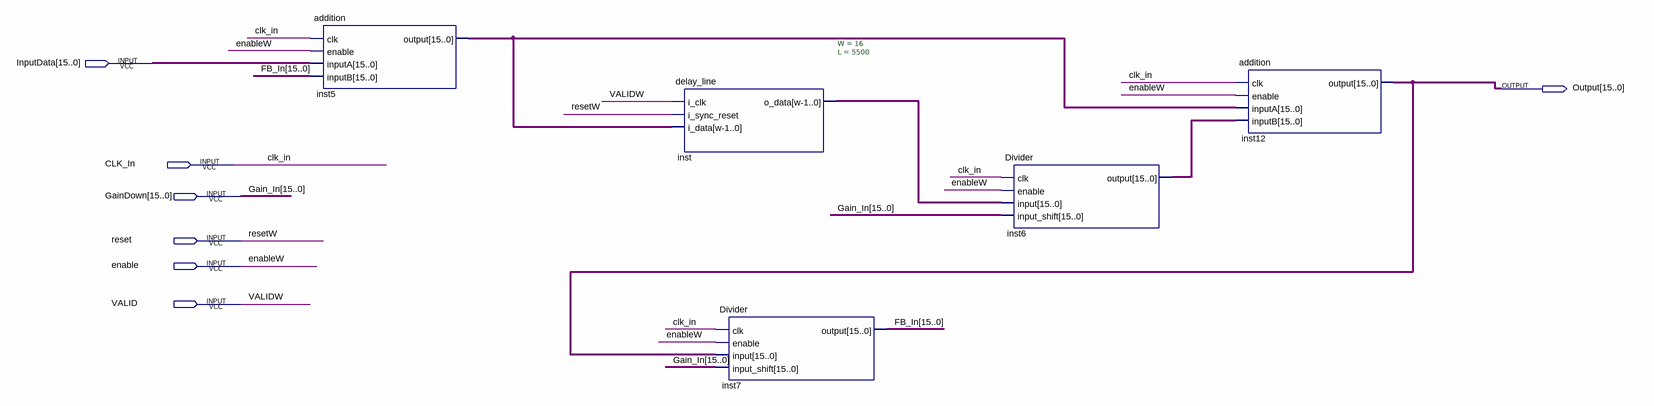
[diagram p0: schematic sheet]
// Quartus schematic ECHOTEST01.bdf as structural Verilog: 5 symbols, 7 pins
module ECHOTEST01 (
  input  [15:0] InputData,
  input  CLK_In,
  input  [15:0] GainDown,
  input  reset,
  input  enable,
  input  VALID,
  output [15:0] Output
);

  wire [15:0] FB_In, inst5_output, inst6_output, inst_o_data;

  addition inst5 (.clk(CLK_In), .enable(enable), .inputA(InputData), .inputB(FB_In), .\output (inst5_output));
  delay_line #(.W(16), .L(5500)) inst (
    .i_clk(VALID), .i_sync_reset(reset), .i_data(inst5_output), .o_data(inst_o_data));
  Divider inst7 (.clk(CLK_In), .enable(enable), .\input (Output), .input_shift(GainDown), .\output (FB_In));
  Divider inst6 (.clk(CLK_In), .enable(enable), .\input (inst_o_data), .input_shift(GainDown), .\output (inst6_output));
  addition inst12 (.clk(CLK_In), .enable(enable), .inputA(inst5_output), .inputB(inst6_output), .\output (Output));

  // Other names for the same wires on the sheet: enableW = enable; Gain_In[15:0] = GainDown; resetW = reset;
  //   VALIDW = VALID
endmodule
